# EasyEDA schematic SCH_PicoCounter_v2.json

## Sheets
1 Channel Inputs: TITLE: Channel Inputs; REV: 1.0; Date: 2021-10-09; Sheet: 1/1; Drawn By: fmefi; Company: Your Company
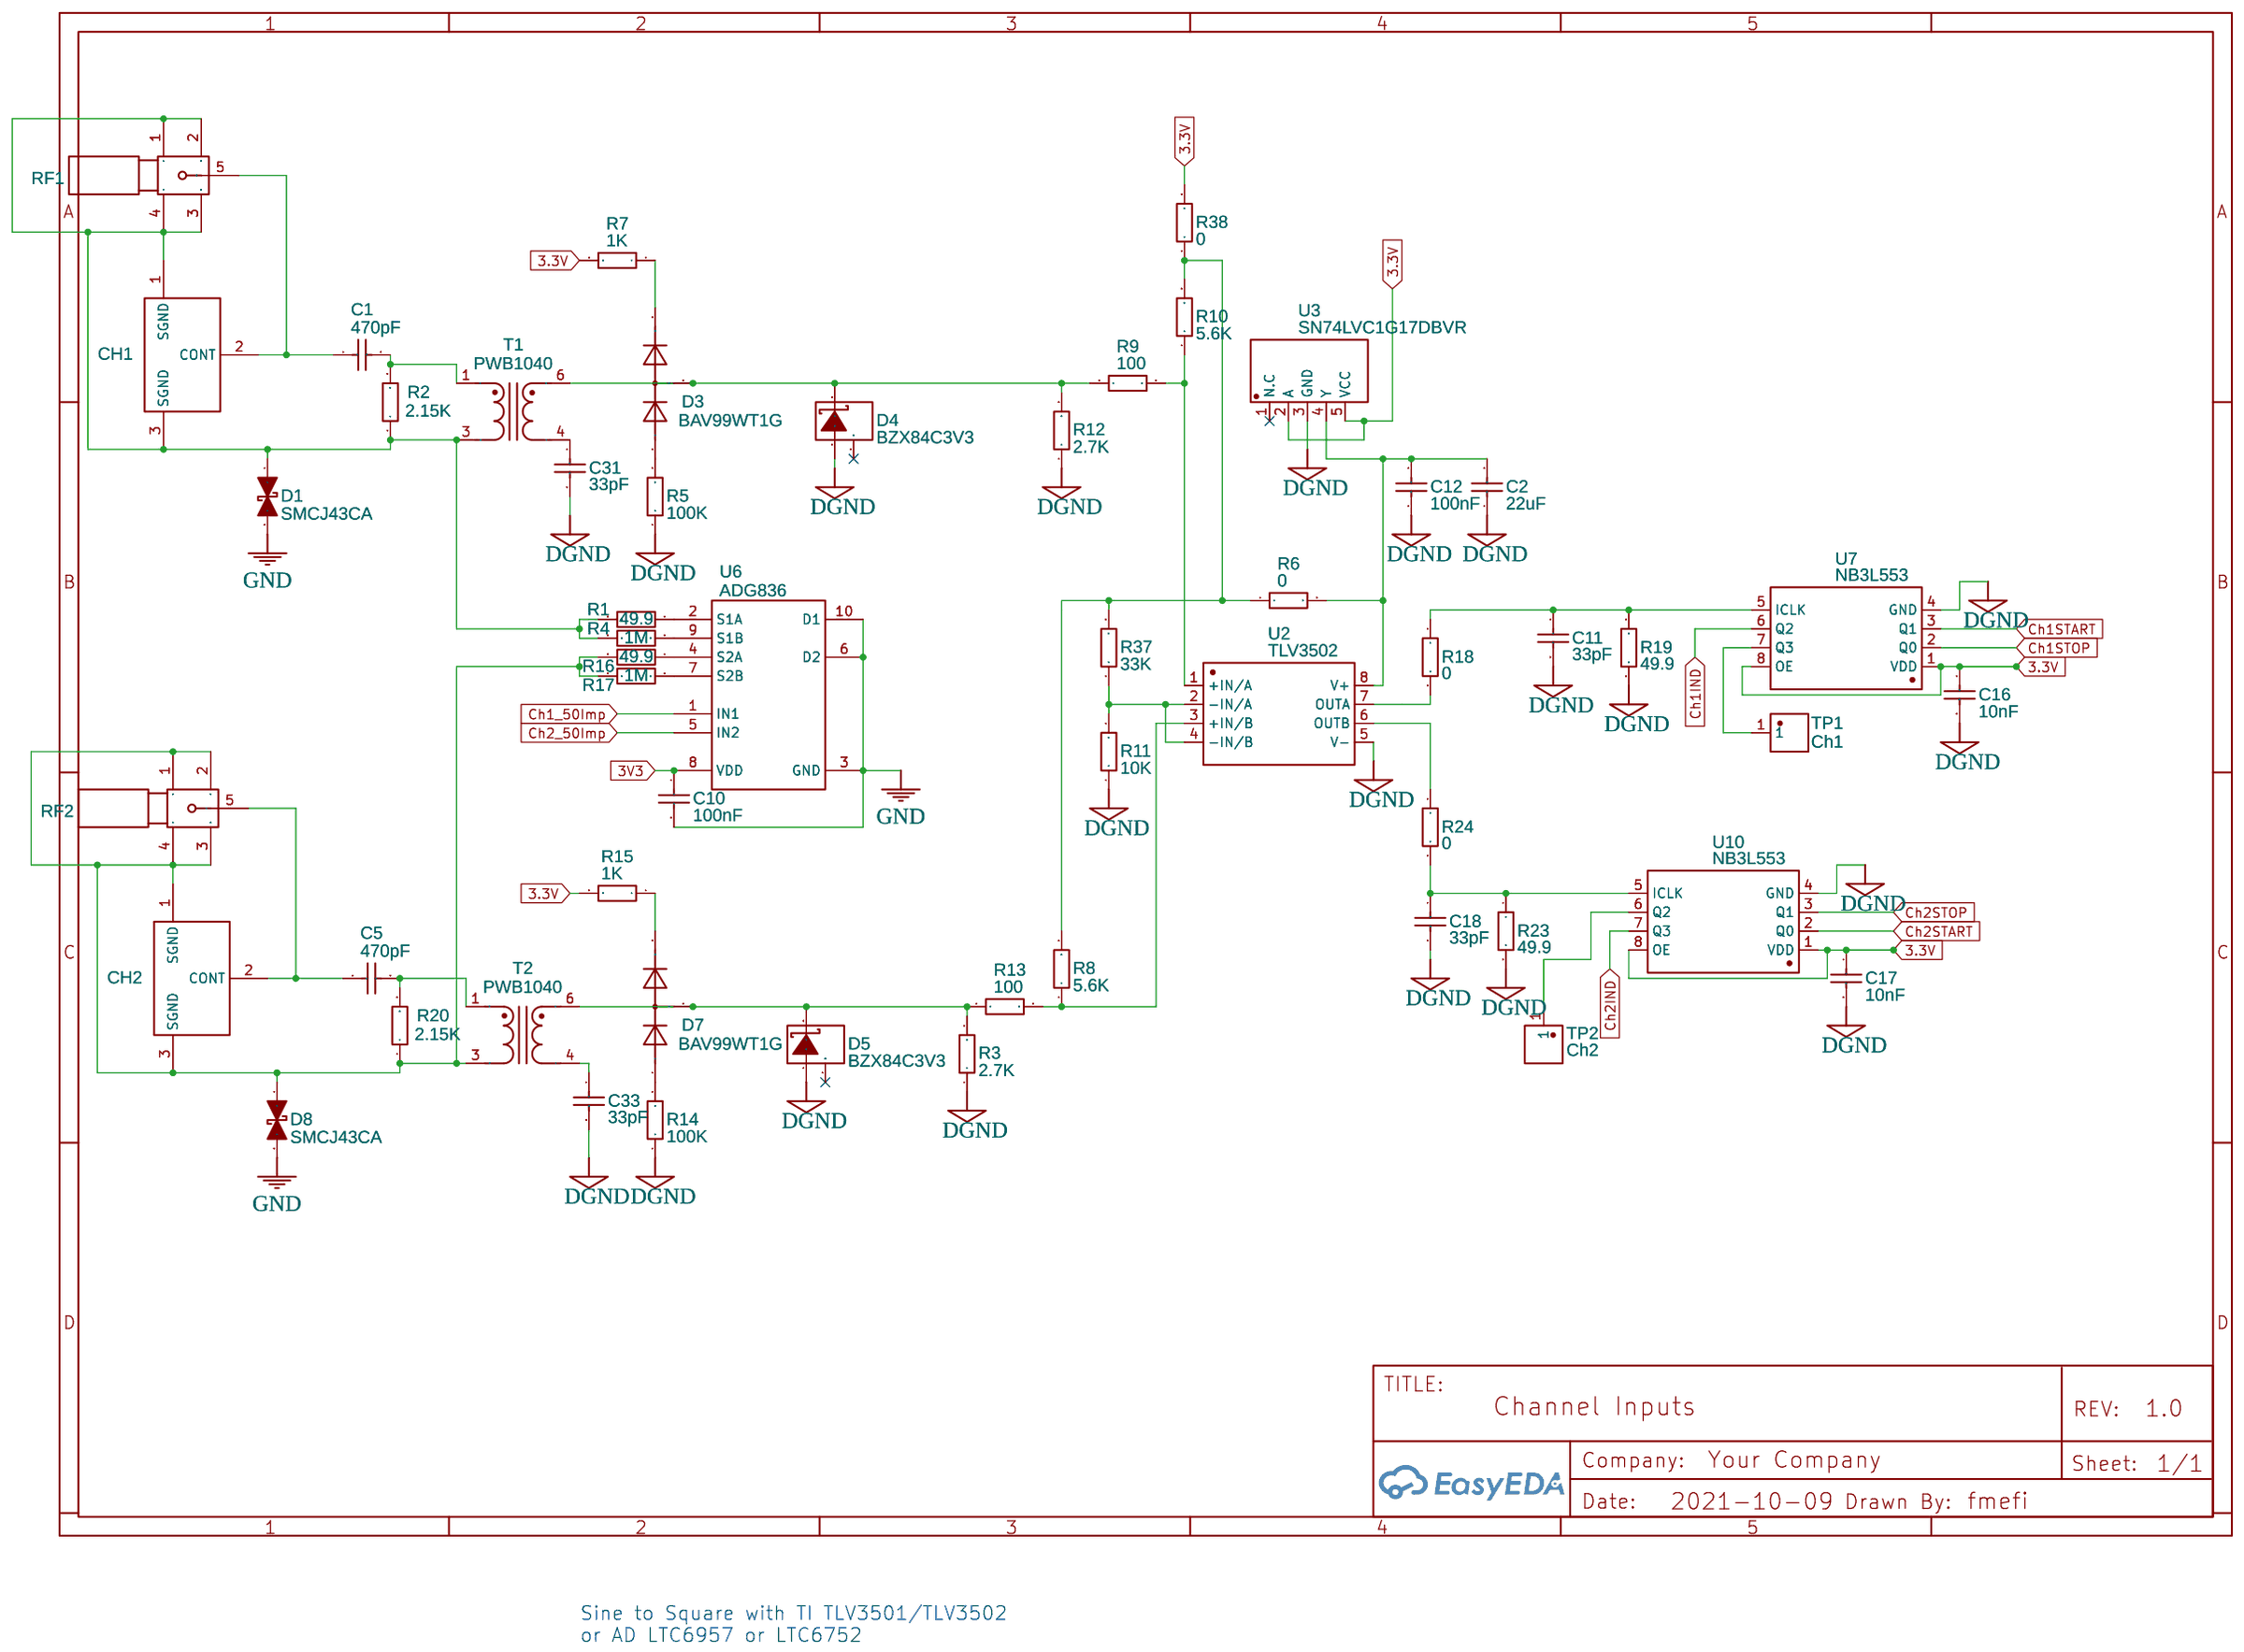
[diagram p0: Channel Inputs]
2 TDC7200: TITLE: TDC7200 Counter; Date: 2021-11-24
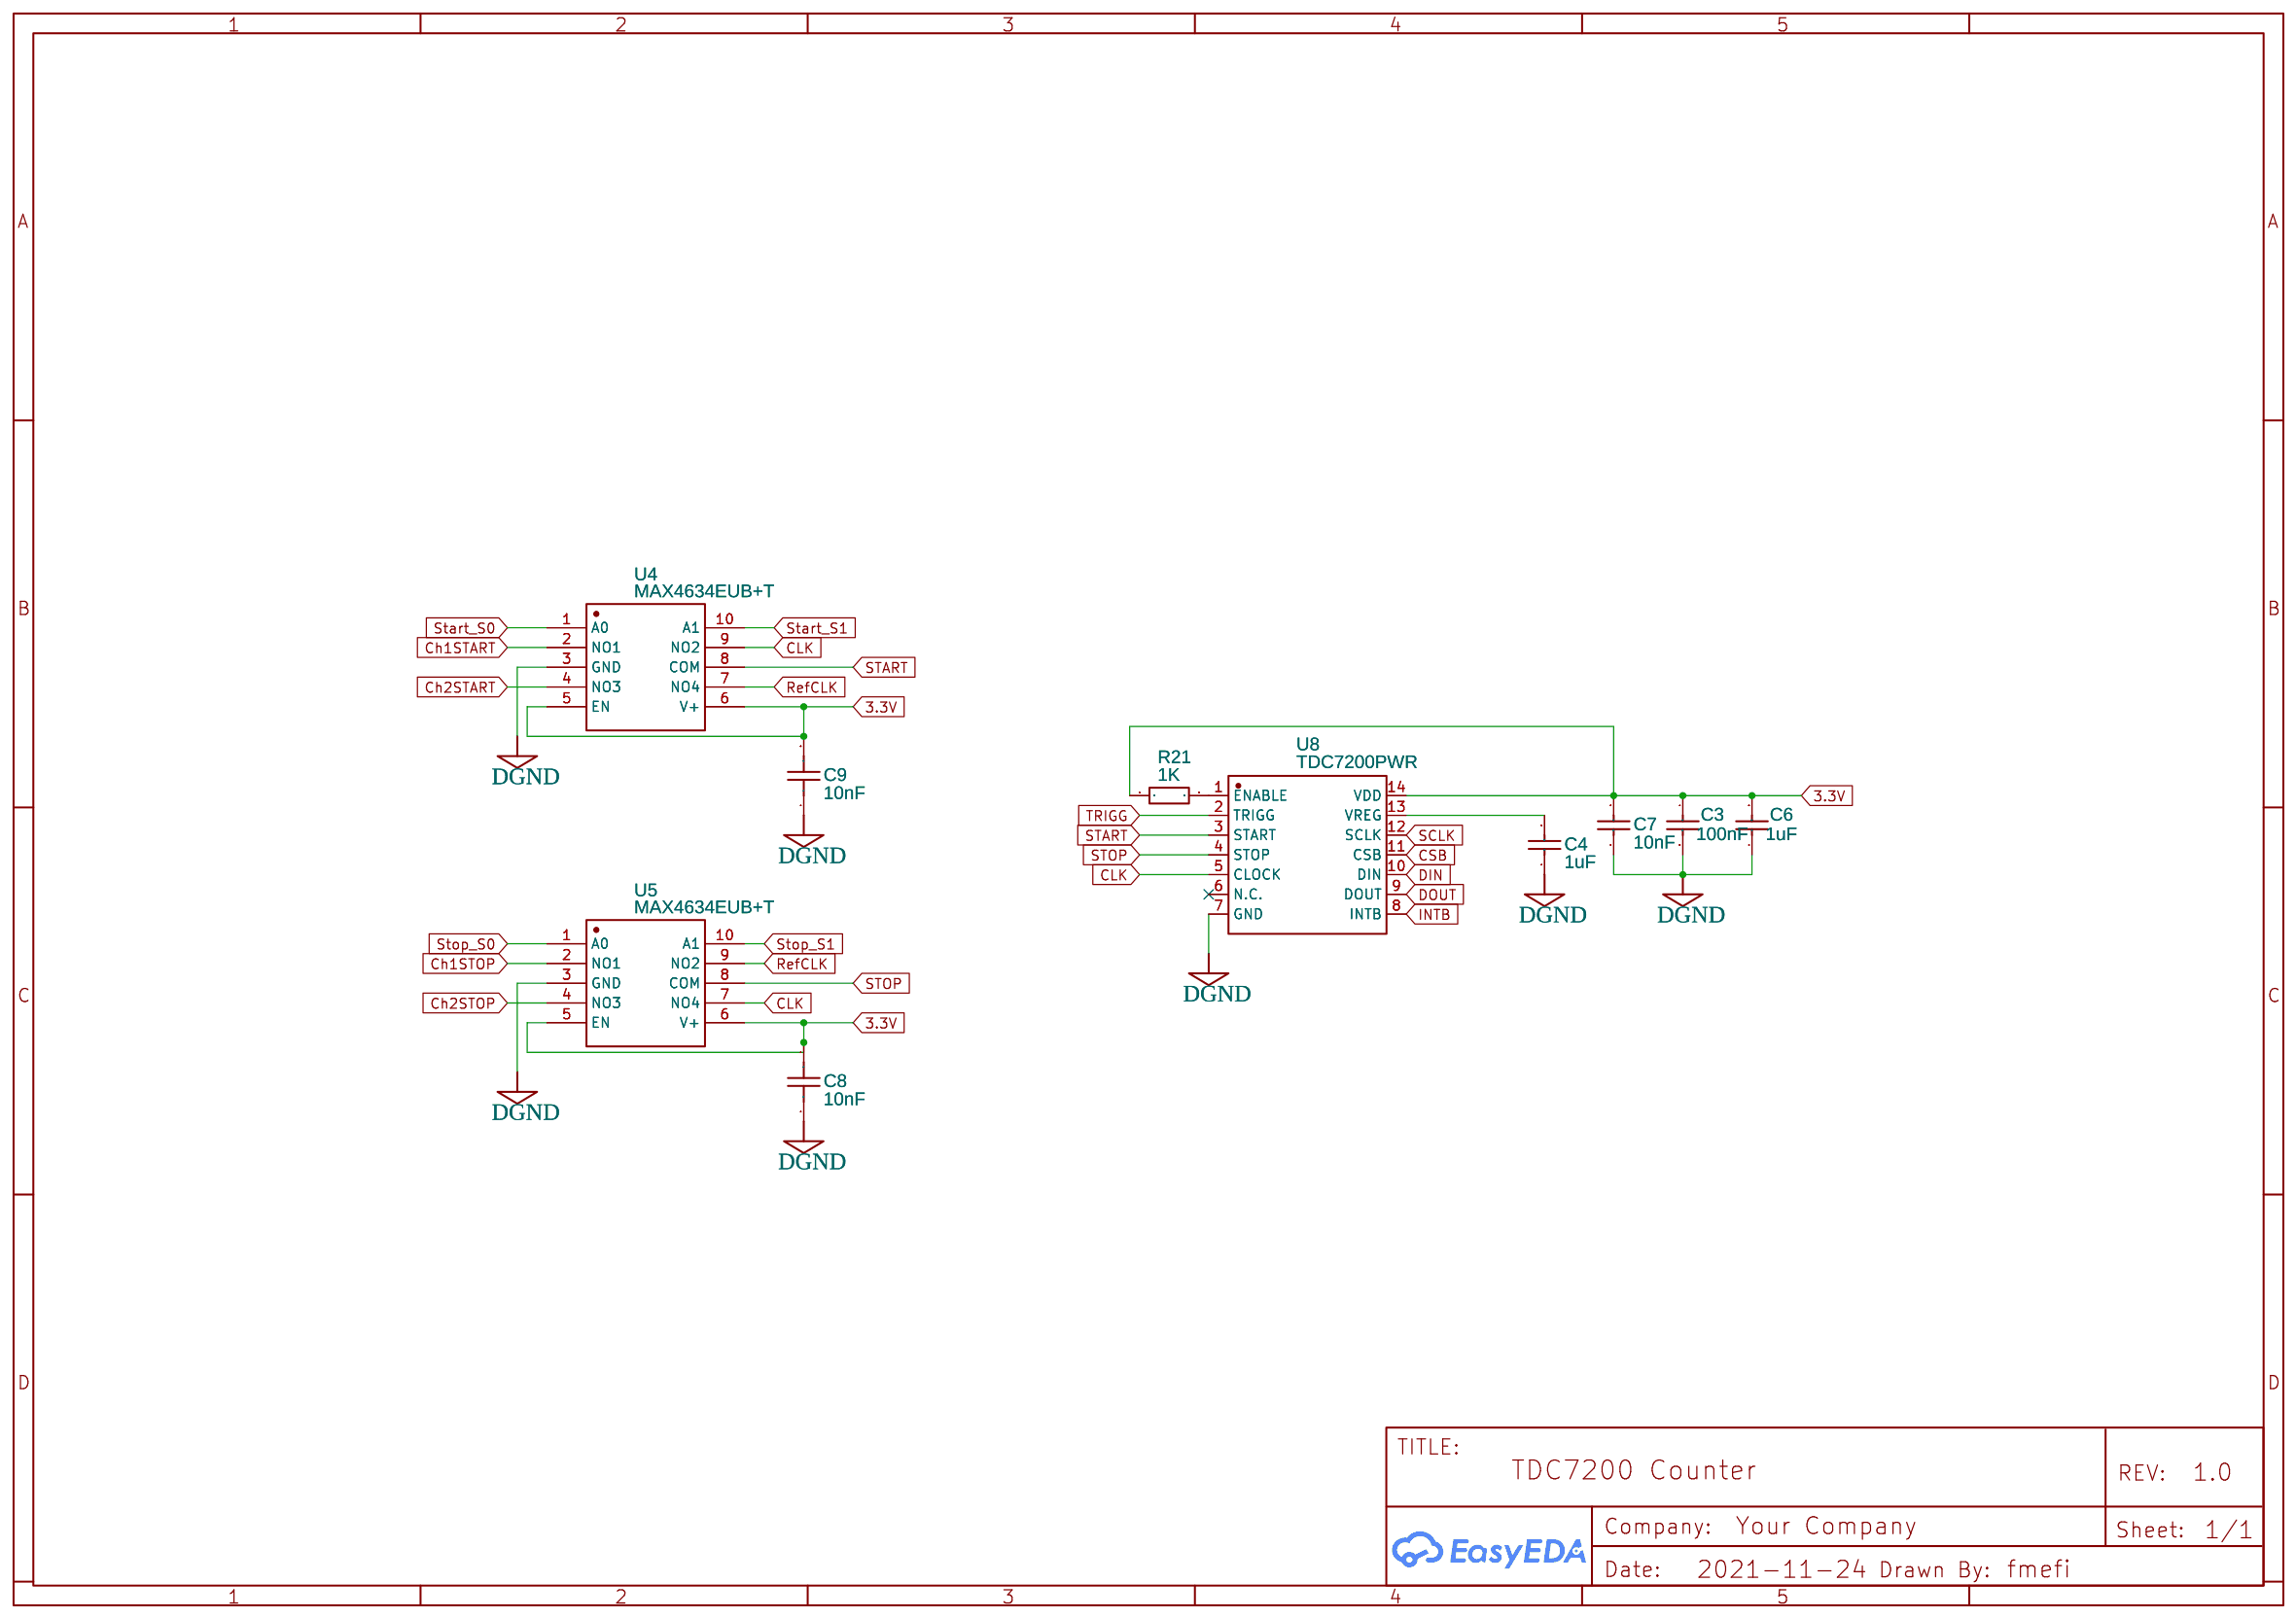
[diagram p1: TDC7200]
3 RPi Pico: TITLE: RPi Pico (Div Module); Date: 2021-11-24
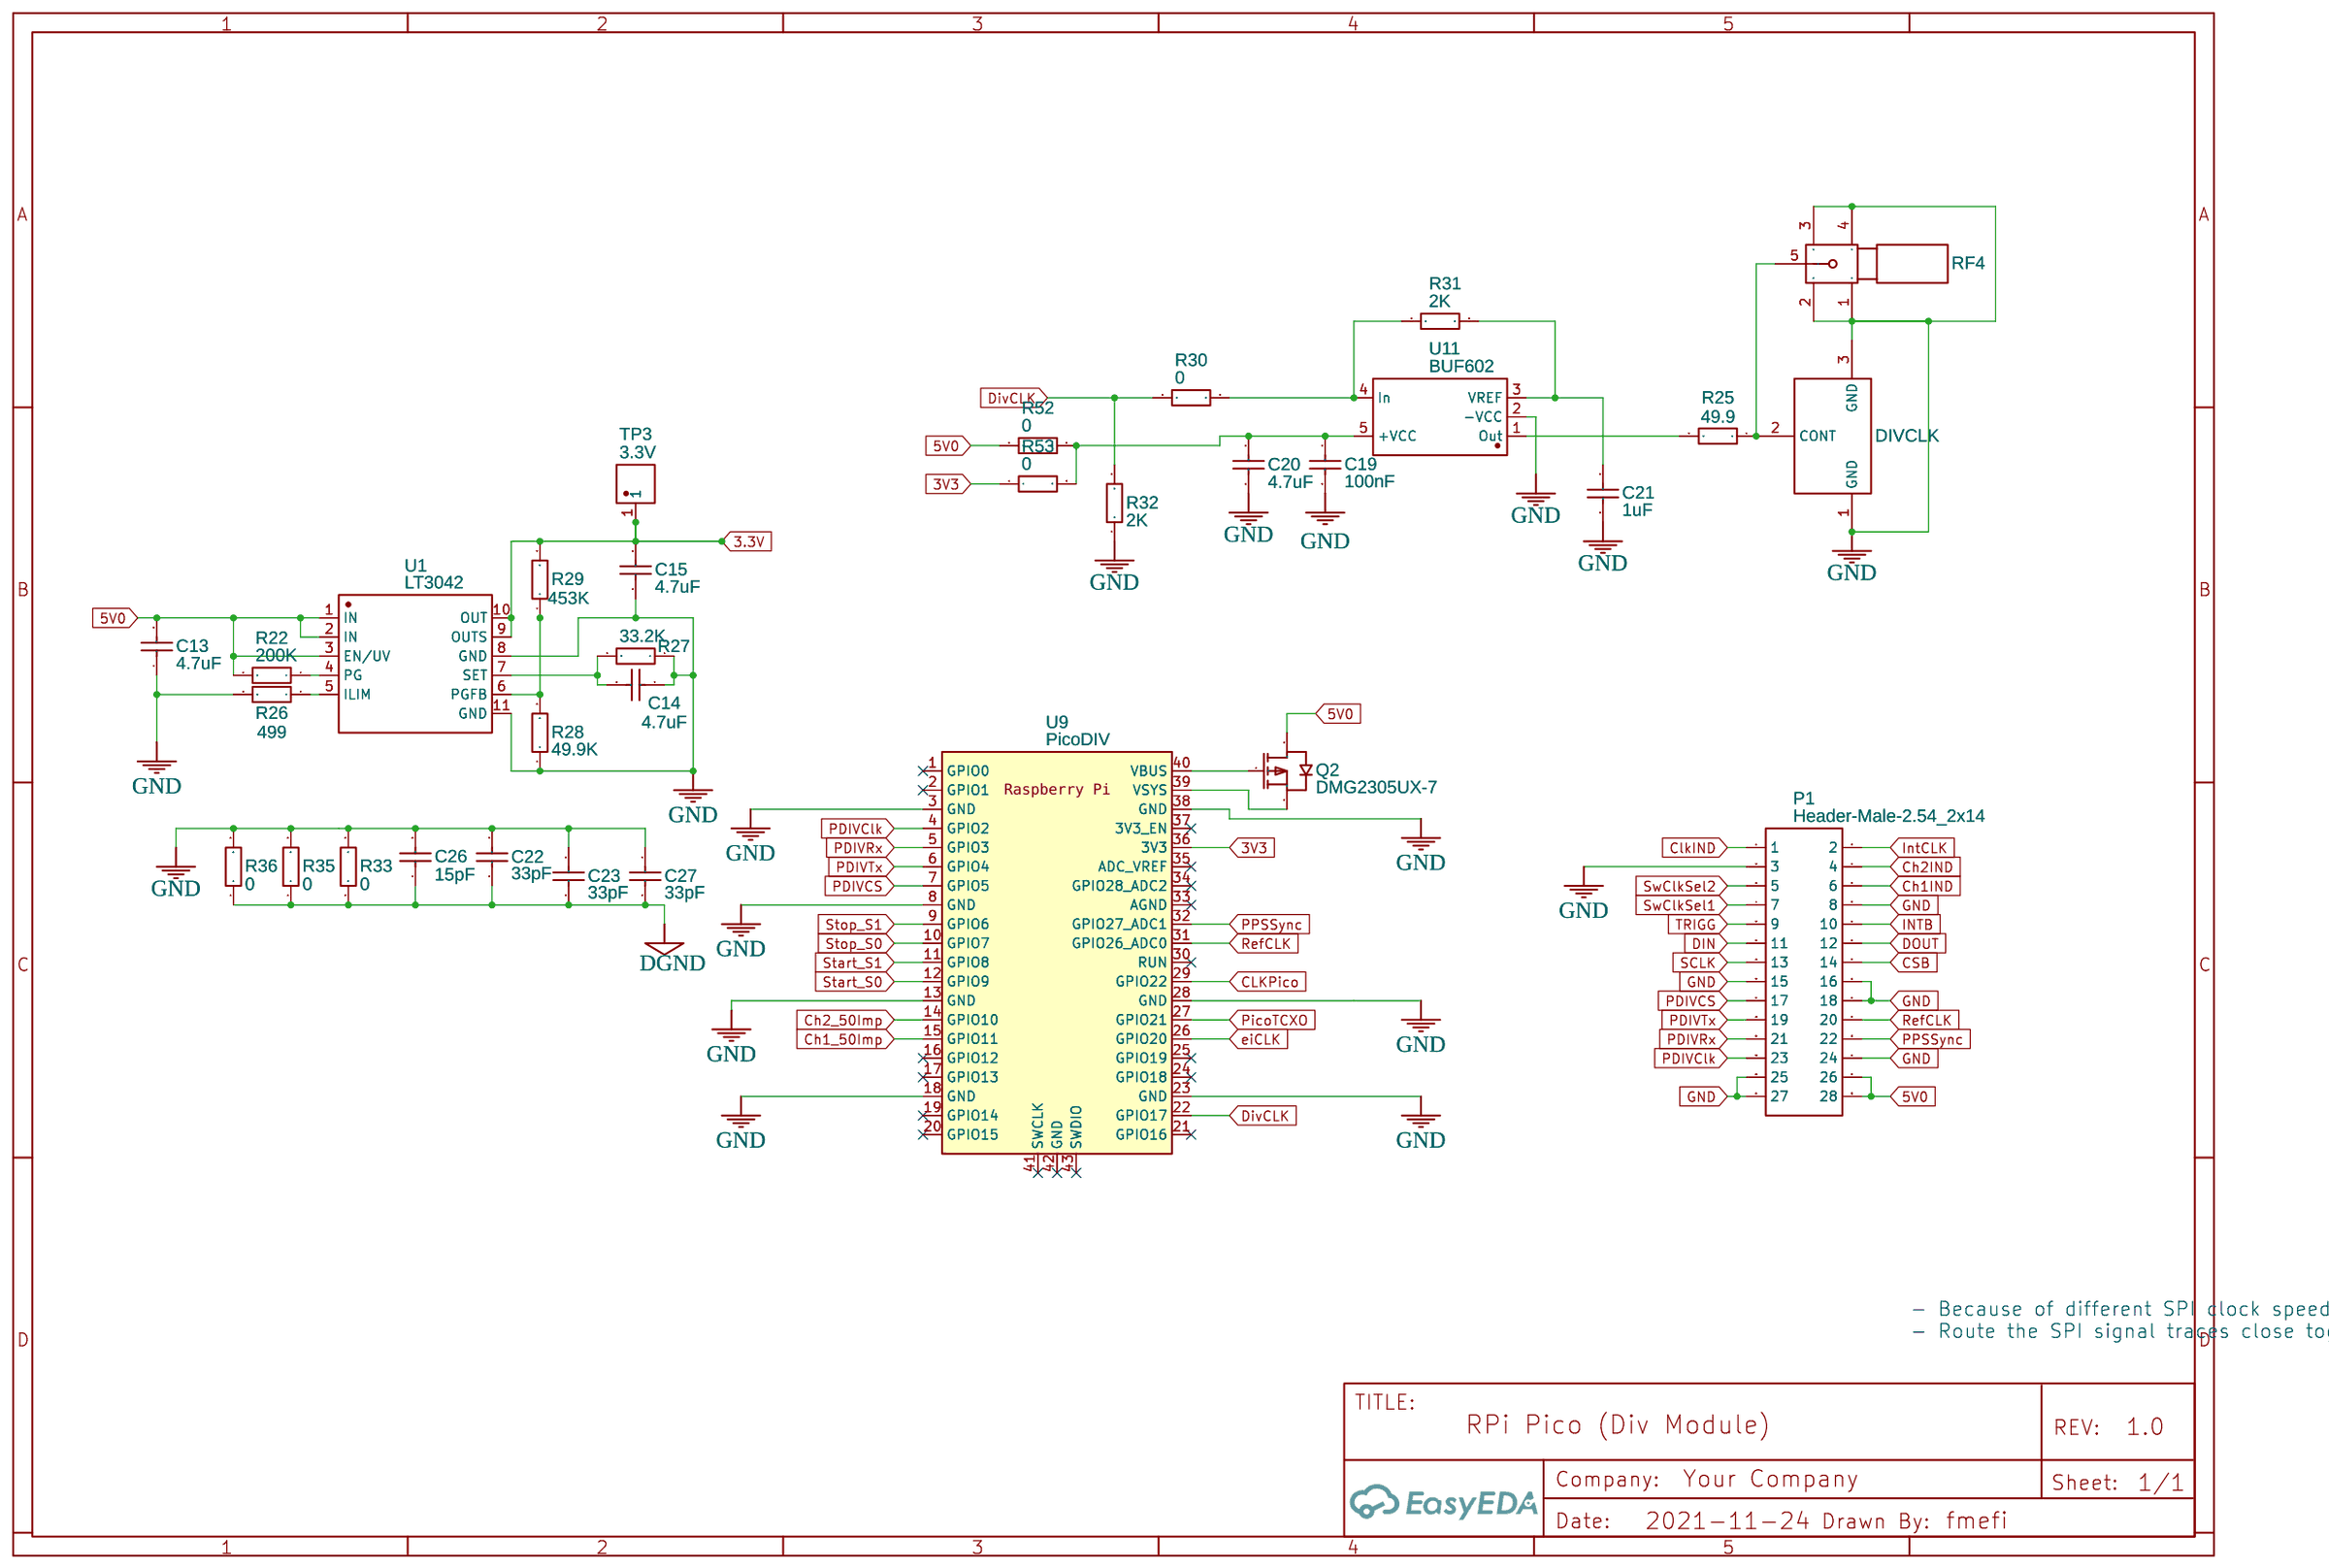
[diagram p2: RPi Pico]
4 Timebase: TITLE: Timebase; Date: 2021-11-25
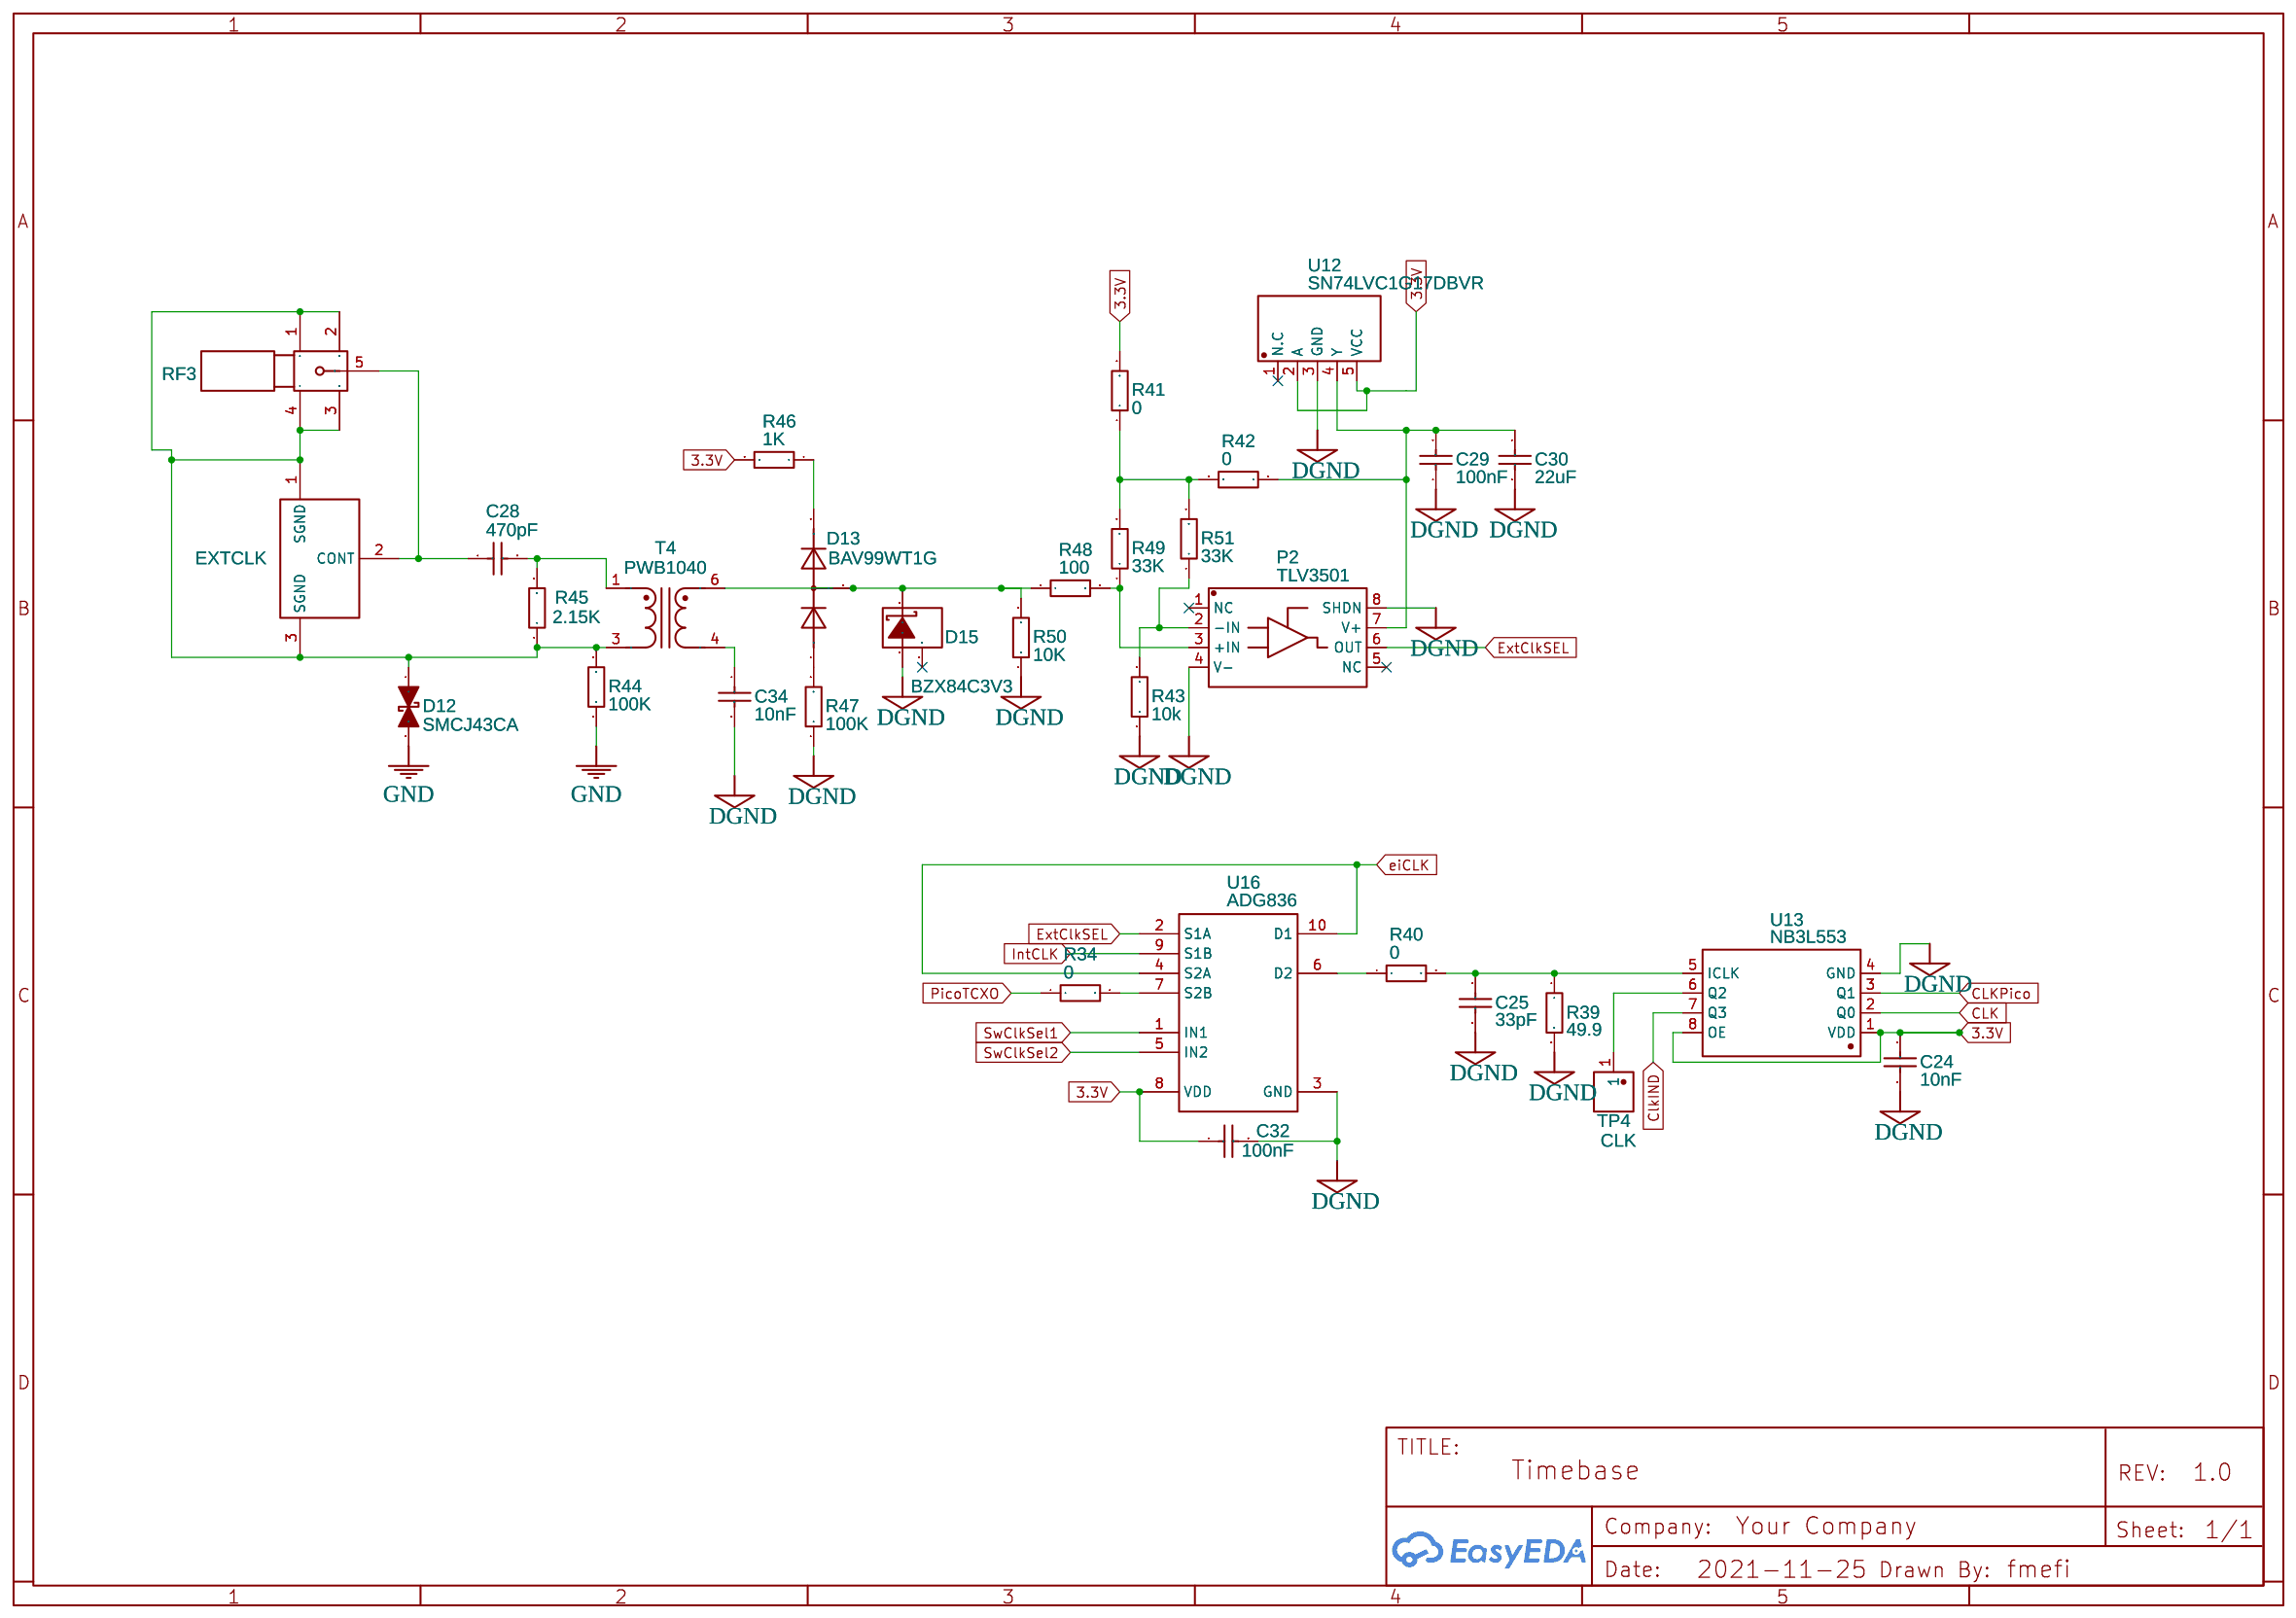
[diagram p3: Timebase]

## Parts
sheet Channel Inputs
C1  470pF  [C0805]
C2  22uF  [C0805]
C5  470pF  [C0805]
C10  100nF  [C0805]
C11  33pF  [C0805]
C12  100nF  [C0805]
C16  10nF  [C0805]
C17  10nF  [C0805]
C18  33pF  [C0805]
C31  33pF  [C0805]
C33  33pF  [C0805]
CH1  ChA  [ANT-SMD_KH-IPEX-K501-29]
CH2  ChA  [ANT-SMD_KH-IPEX-K501-29]
D1  SMCJ43CA  [SMC_L6.9-W5.9-LS7.9-BI]
D3  BAV99WT1G  [SC-70-3_L2.1-W1.3-P1.30-LS2.1-BR]
D4  BZX84C3V3  [SOT-23-3_L2.9-W1.3-P0.95-LS2.4-BR]
D5  BZX84C3V3  [SOT-23-3_L2.9-W1.3-P0.95-LS2.4-BR]
D7  BAV99WT1G  [SC-70-3_L2.1-W1.3-P1.30-LS2.1-BR]
D8  SMCJ43CA  [SMC_L6.9-W5.9-LS7.9-BI]
R1  49.9  [R0805]
R2  2.15K  [R0805]
R3  2.7K  [R0805]
R4  1M  [R0805]
R5  100K  [R0805]
R6  0  [R0805]
R7  1K  [R0805]
R8  5.6K  [R0805]
R9  100  [R0805]
R10  5.6K  [R0805]
R11  10K  [R0805]
R12  2.7K  [R0805]
R13  100  [R0805]
R14  100K  [R0805]
R15  1K  [R0805]
R16  49.9  [R0805]
R17  1M  [R0805]
R18  0  [R0805]
R19  49.9  [R0805]
R20  2.15K  [R0805]
R23  49.9  [R0805]
R24  0  [R0805]
R37  33K  [R0805]
R38  0  [R0805]
RF1  KH-SMA-KE8-G  [CONN-SMD_KH-SMA-KE8-G]
RF2  KH-SMA-KE8-G  [CONN-SMD_KH-SMA-KE8-G]
T1  PWB1040  [PWB1040 COILCRAFT]
T2  PWB1040  [PWB1040 COILCRAFT]
TP1  Ch1  [TP-SMD_RCUCTE]
TP2  Ch2  [TP-SMD_RCUCTE]
U2  TLV3502  [SOIC-8_L4.9-W3.9-P1.27-LS6.0-BL]
U3  SN74LVC1G17DBVR  [SOT-23-5_L3.0-W1.7-P0.95-LS2.8-BR]
U6  ADG836  [MSOP-10_L3.0-W3.0-P0.50-LS5.0-BL]
U7  NB3L553  [SOIC-8_L4.9-W3.9-P1.27-LS6.0-BL]
U10  NB3L553  [SOIC-8_L4.9-W3.9-P1.27-LS6.0-BL]
sheet RPi Pico
C13  4.7uF  [C0805]
C14  4.7uF  [C0805]
C15  4.7uF  [C0805]
C19  100nF  [C0805]
C20  4.7uF  [C0805]
C21  1uF  [C0805]
C22  33pF  [C0805]
C23  33pF  [C0805]
C26  15pF  [C0805]
C27  33pF  [C0805]
DIVCLK  DIVCLK  [ANT-SMD_KH-IPEX-K501-29]
P1  Header-Male-2.54_2x14  [HDR-TH_28P-P2.54-H-M-R2-C14-S2.54]
Q2  DMG2305UX-7  [SOT-23-3_L2.9-W1.3-P1.90-LS2.4-BR]
R22  200K  [R0805]
R25  49.9  [R0805]
R26  499  [R0805]
R27  33.2K  [R0805]
R28  49.9K  [R0805]
R29  453K  [R0805]
R30  0  [R0805]
R31  2K  [R0805]
R32  2K  [R0805]
R33  0  [R0805]
R35  0  [R0805]
R36  0  [R0805]
R52  0  [R0805]
R53  0  [R0805]
RF4  KH-SMA-KE8-G  [CONN-SMD_KH-SMA-KE8-G]
TP3  3.3V  [TP-SMD_RCUCTE]
U1  LT3042  [MSOP-10_L3.0-W3.0-P0.50-LS5.0-BL-EP]
U9  PicoDIV  [RPI_PICO_SMD_TH]
U11  BUF602  [SOT-23-5_L2.9-W1.6-P0.95-LS2.8-BL]
sheet TDC7200
C3  100nF  [C0805]
C4  1uF  [C0805]
C6  1uF  [C0805]
C7  10nF  [C0805]
C8  10nF  [C0805]
C9  10nF  [C0805]
R21  1K  [R0805]
U4  MAX4634EUB+T  [MSOP-10_L3.0-W3.0-P0.50-LS5.0-BL]
U5  MAX4634EUB+T  [MSOP-10_L3.0-W3.0-P0.50-LS5.0-BL]
U8  TDC7200PWR  [TSSOP-14_L5.0-W4.4-P0.65-LS6.4-BL]
sheet Timebase
C24  10nF  [C0805]
C25  33pF  [C0805]
C28  470pF  [C0805]
C29  100nF  [C0805]
C30  22uF  [C0805]
C32  100nF  [C0805]
C34  10nF  [C0805]
D12  SMCJ43CA  [SMC_L6.9-W5.9-LS7.9-BI]
D13  BAV99WT1G  [SC-70-3_L2.1-W1.3-P1.30-LS2.1-BR]
D15  BZX84C3V3  [SOT-23-3_L2.9-W1.3-P0.95-LS2.4-BR]
EXTCLK  ChA  [ANT-SMD_KH-IPEX-K501-29]
P2  TLV3501  [SOP-8_L4.9-W3.9-P1.27-LS6.0-BL]
R34  0  [R0805]
R39  49.9  [R0805]
R40  0  [R0805]
R41  0  [R0805]
R42  0  [R0805]
R43  10k  [R0805]
R44  100K  [R0805]
R45  2.15K  [R0805]
R46  1K  [R0805]
R47  100K  [R0805]
R48  100  [R0805]
R49  33K  [R0805]
R50  10K  [R0805]
R51  33K  [R0805]
RF3  KH-SMA-KE8-G  [CONN-SMD_KH-SMA-KE8-G]
T4  PWB1040  [PWB1040 COILCRAFT]
TP4  CLK  [TP-SMD_RCUCTE]
U12  SN74LVC1G17DBVR  [SOT-23-5_L3.0-W1.7-P0.95-LS2.8-BR]
U13  NB3L553  [SOIC-8_L4.9-W3.9-P1.27-LS6.0-BL]
U16  ADG836  [MSOP-10_L3.0-W3.0-P0.50-LS5.0-BL]

## Library data of the parts
C1 C5 C28 = CL21C471JBANNNC: Supplier: LCSC; Manufacturer: SAMSUNG; Supplier Part: C28256; JLCPCB Part Class: Extended Part
C2 C30 = CL21A226MPQNNNE: Supplier: LCSC; Manufacturer: SAMSUNG; Supplier Part: C29277; JLCPCB Part Class: Extended Part
C3 C10 C12 C19 C29 C32 = CC0805KRX7R9BB104: Supplier: LCSC; Manufacturer: YAGEO; Supplier Part: C49678; JLCPCB Part Class: Basic Part
C11 C18 C22 C23 C25 C27 C31 C33 = CL21C330JBANNNC: Supplier: LCSC; Manufacturer: SAMSUNG; Supplier Part: C1814; JLCPCB Part Class: Basic Part
C7 C16 C17 C24 C34 = CL21B103KBANNNC: Supplier: LCSC; Manufacturer: SAMSUNG; Supplier Part: C1710; JLCPCB Part Class: Basic Part
CH1 CH2 DIVCLK EXTCLK = KH-IPEX-K501-29: Supplier: LCSC; Supplier Part: C411563; Manufacturer: Shenzhen Kinghelm Elec; Contributor: LCSC; JLCPCB Part Class: Extended Part
D1 D8 D12 = SMCJ43CA: Supplier: LCSC; Supplier Part: C310053; Manufacturer: Brightking Elec (TAIWAN); Contributor: LCSC; JLCPCB Part Class: Extended Part
D3 D7 D13 = BAV99WT1G: Supplier Part: C82078; Supplier: LCSC; Manufacturer: ON; Contributor: LCSC; JLCPCB Part Class: Extended Part
D4 D5 D15 = SZBZX84C3V3LT1G: Supplier: LCSC; Supplier Part: C231240; Manufacturer: ON Semicon; Contributor: LCSC; JLCPCB Part Class: Extended Part
R1 R16 R19 R23 R25 R39 = 0805W8F499JT5E: Supplier: LCSC; Manufacturer: UniOhm; Supplier Part: C17720; JLCPCB Part Class: Basic Part
R2 R20 R45 = 0805W8F2151T5E: Supplier: LCSC; Manufacturer: UniOhm; Supplier Part: C17516; JLCPCB Part Class: Extended Part
R3 R12 = 0805W8F1002T5E: Supplier: LCSC; Manufacturer: UniOhm; Manufacturer Part: 0805W8F2701T5E; Supplier Part: C17530; JLCPCB Part Class: Basic Part
R4 R17 = 0805W8F1004T5E: Supplier: LCSC; Manufacturer: UniOhm; Supplier Part: C17514; JLCPCB Part Class: Basic Part
R5 R14 R44 R47 = 0805W8F1003T5E: Supplier: LCSC; Manufacturer: UniOhm; Supplier Part: C17407; JLCPCB Part Class: Basic Part
R6 R18 R24 R30 R33-R36 R38 R40-R42 R52 R53 = 0805W8F0000T5E: Supplier: LCSC; Manufacturer: UniOhm; Supplier Part: C17477; JLCPCB Part Class: Basic Part
R7 R15 R21 R46 = 0805W8F1001T5E: Supplier: LCSC; Manufacturer: UniOhm; Supplier Part: C17513; JLCPCB Part Class: Basic Part
R8 R10 = 0805W8F1003T5E: Supplier: LCSC; Manufacturer: UniOhm; Manufacturer Part: 0805W8F5601T5E; Supplier Part: C4382; JLCPCB Part Class: Basic Part
R9 R13 R48 = 0805W8F1000T5E: Supplier: LCSC; Manufacturer: UniOhm; Supplier Part: C17408; JLCPCB Part Class: Basic Part
R11 R43 = 0805W8F1000T5E: Supplier: LCSC; Manufacturer: UniOhm; Manufacturer Part: 0805W8F1002T5E; Supplier Part: C17414; JLCPCB Part Class: Basic Part
R37 R49 R51 = 0805W8F1003T5E: Supplier: LCSC; Manufacturer: UniOhm; Manufacturer Part: 0805W8F3302T5E; Supplier Part: C17633; JLCPCB Part Class: Basic Part
RF1-RF4 = KH-SMA-KE8-G: Supplier: LCSC; Supplier Part: C530661; Manufacturer: Shenzhen Kinghelm Elec; Contributor: LCSC; JLCPCB Part Class: Extended Part
T1 T2 T4 = PWB1040 COILCRAFT: Supplier: LCSC; Supplier Part: C581397; Manufacturer: Pulse Elec; Manufacturer Part: PE-68386NLT; Contributor: LCSC; JLCPCB Part Class: Extended Part
TP1-TP4 = RCUCTE: Supplier: LCSC; Supplier Part: C159867; Manufacturer: KOA; Contributor: LCSC
U2 = TLV3502AIDR: Supplier: LCSC; Manufacturer: TI; Contributor: LCSC; Supplier Part: C131165; JLCPCB Part Class: Extended Part
U3 U12 = SN74LVC1G17DBVR: Supplier: LCSC; Manufacturer: TI; Supplier Part: C7836; JLCPCB Part Class: Extended Part
U6 U16 = ADG836YRMZ: Supplier: LCSC; Supplier Part: C208153; Manufacturer: Analog Devices; Contributor: LCSC; JLCPCB Part Class: Extended Part
U7 U10 U13 = NB3L553DR2G: Supplier: LCSC; Manufacturer: ON; Contributor: LCSC; Supplier Part: C145512; JLCPCB Part Class: Extended Part
C13-C15 C20 = CL21A475KAQNNNE: Supplier: LCSC; Manufacturer: SAMSUNG; Supplier Part: C1779; JLCPCB Part Class: Basic Part
C4 C6 C21 = CL21B105KBFNNNE: Supplier: LCSC; Manufacturer: SAMSUNG; Supplier Part: C28323; JLCPCB Part Class: Basic Part
C26 = CL21C150JBANNNC: Supplier: LCSC; Manufacturer: SAMSUNG; Supplier Part: C1794; JLCPCB Part Class: Basic Part
P1 = Header-Male-2.54_2x14: Supplier: LCSC; Manufacturer: Ckmtw; Manufacturer Part: 210R-2*14PCurved needle Gold-plated black; Contributor: LCSC; Supplier Part: C124368; JLCPCB Part Class: Extended Part
Q2 = DMG2305UX-7: Supplier: LCSC; Supplier Part: C150470; Manufacturer: Diodes Incorporated; Contributor: LCSC; JLCPCB Part Class: Extended Part
R22 = 0805W8F2003T5E: Supplier: LCSC; Manufacturer: UniOhm; Supplier Part: C17539; JLCPCB Part Class: Basic Part
R26 = 0805W8F4990T5E: Supplier: LCSC; Manufacturer: UniOhm; Supplier Part: C17722; JLCPCB Part Class: Extended Part
R27 = 0805W8F3322T5E: Supplier: LCSC; Manufacturer: UniOhm; Supplier Part: C37252; JLCPCB Part Class: Extended Part
R28 = 0805W8F4992T5E: Supplier: LCSC; Manufacturer: UniOhm; Supplier Part: C17719; JLCPCB Part Class: Basic Part
R29 = 0805W8F4533T5E: Supplier: LCSC; Manufacturer: UniOhm; Supplier Part: C17702; JLCPCB Part Class: Extended Part
R31 R32 = 0805W8F2001T5E: Supplier: LCSC; Manufacturer: UniOhm; Supplier Part: C17604; JLCPCB Part Class: Basic Part
U1 = LT3042EMSE#PBF: Supplier: LCSC; Manufacturer: LINEAR; Supplier Part: C69847; JLCPCB Part Class: Extended Part
U9 = Pico: Contributor: Alexey Gumenchuk
U11 = BUF602IDBVR: Supplier: LCSC; Supplier Part: C2060701; Manufacturer: TI(德州仪器); JLCPCB Part Class: Extended Part; Contributor: LCSC
C8 C9 = CC0805KRX7R9BB103: Supplier: LCSC; Manufacturer: YAGEO; Supplier Part: C83170; JLCPCB Part Class: Extended Part
U4 U5 = MAX4634EUB+T: Supplier: LCSC; Manufacturer: MAXIM; Contributor: LCSC; Supplier Part: C118342; JLCPCB Part Class: Extended Part
U8 = TDC7200PWR: Supplier: LCSC; Supplier Part: C2653139; Manufacturer: TI(德州仪器); Contributor: LCSC; JLCPCB Part Class: Extended Part
P2 = TLV3501AIDR: Supplier: LCSC; Manufacturer: TI; Supplier Part: C43484; JLCPCB Part Class: Extended Part
R50 = 0805W8F1002T5E: Supplier: LCSC; Manufacturer: UniOhm; Supplier Part: C17414; JLCPCB Part Class: Basic Part

## Nets
3.3V: C3.1 C6.2 C7.2 C8.2 C9.2 C15.2 C16.1 C17.1 C24.1 C32.1 R7.2 R15.2 R21.1 R29.2 R38.2 R41.2 R46.2 TP3.1 U1.9(OUTS) U1.10(OUT) U3.2(A) U3.5(VCC) U4.5(EN) U4.6(V+) U5.5(EN) U5.6(V+) U7.1(VDD) U7.8(OE) U8.14(VDD) U10.1(VDD) U10.8(OE) U12.2(A) U12.5(VCC) U13.1(VDD) U13.8(OE) U16.8(VDD)
3V3: C10.1 R53.1 U6.8(VDD) U9.36(3V3)
5V0: C13.2 P1.26 P1.28 Q2.3(D) R22.2 R52.1 U1.1(IN) U1.2(IN) U1.3(EN/UV)
DGND: C2.1 C3.2 C4.1 C6.1 C7.1 C8.1 C9.1 C11.2 C12.1 C16.2 C17.2 C18.2 C22.1 C23.1 C24.2 C25.2 C26.1 C27.1 C29.1 C30.1 C31.2 C32.2 C33.2 C34.2 D4.1(A) D5.1(A) D15.1(A) P2.4(V-) P2.8(SHDN) R3.1 R5.1 R11.1 R12.1 R14.1 R19.2 R23.2 R33.1 R35.1 R36.1 R39.2 R43.1 R47.1 R50.1 U2.5(V-) U3.3(GND) U4.3(GND) U5.3(GND) U7.4(GND) U8.7(GND) U10.4(GND) U12.3(GND) U13.4(GND) U16.3(GND)
GND: C10.2 C13.1 C14.1 C15.1 C19.2 C20.2 C21.1 C22.2 C23.2 C26.2 C27.2 D1.2(A) D8.2(A) D12.2(A) DIVCLK.1(GND) DIVCLK.3(GND) P1.3 P1.8 P1.15 P1.16 P1.18 P1.24 P1.25 P1.27 R26.2 R27.1 R28.1 R32.1 R33.2 R35.2 R36.2 R44.1 RF4.1 RF4.2 RF4.3 RF4.4 U1.8(GND) U1.11(GND) U6.3(GND) U6.6(D2) U6.10(D1) U9.3(GND) U9.8(GND) U9.13(GND) U9.18(GND) U9.23(GND) U9.28(GND) U9.38(GND) U11.2(−VCC)
Ch1_50Imp: U6.1(IN1) U9.15(GPIO11)
Ch1IND: P1.6 U7.6(Q2)
Ch1START: U4.2(NO1) U7.3(Q1)
Ch1STOP: U5.2(NO1) U7.2(Q0)
Ch2_50Imp: U6.5(IN2) U9.14(GPIO10)
Ch2IND: P1.4 U10.7(Q3)
Ch2START: U4.4(NO3) U10.2(Q0)
Ch2STOP: U5.4(NO3) U10.3(Q1)
CLK: U4.9(NO2) U5.7(NO4) U8.5(CLOCK) U13.2(Q0)
ClkIND: P1.1 U13.7(Q3)
CLKPico: U9.29(GPIO22) U13.3(Q1)
CSB: P1.14 U8.11(CSB)
DIN: P1.11 U8.10(DIN)
DivCLK: R30.1 R32.2 U9.22(GPIO17)
DOUT: P1.12 U8.9(DOUT)
eiCLK: U9.26(GPIO20) U16.4(S2A) U16.10(D1)
ExtClkSEL: P2.6(OUT) U16.2(S1A)
INTB: P1.10 U8.8(INTB)
IntCLK: P1.2 U16.9(S1B)
PDIVClk: P1.23 U9.4(GPIO2)
PDIVCS: P1.17 U9.7(GPIO5)
PDIVRx: P1.21 U9.5(GPIO3)
PDIVTx: P1.19 U9.6(GPIO4)
PicoTCXO: R34.1 U9.27(GPIO21)
PPSSync: P1.22 U9.32(GPIO27_ADC1)
RefCLK: P1.20 U4.7(NO4) U5.9(NO2) U9.31(GPIO26_ADC0)
SCLK: P1.13 U8.12(SCLK)
START: U4.8(COM) U8.3(START)
Start_S0: U4.1(A0) U9.12(GPIO9)
Start_S1: U4.10(A1) U9.11(GPIO8)
STOP: U5.8(COM) U8.4(STOP)
Stop_S0: U5.1(A0) U9.10(GPIO7)
Stop_S1: U5.10(A1) U9.9(GPIO6)
SwClkSel1: P1.7 U16.1(IN1)
SwClkSel2: P1.5 U16.5(IN2)
TRIGG: P1.9 U8.2(TRIGG)
Net-(C1-1): C1.1 CH1.2(CONT) RF1.5
Net-(C1-2): C1.2 R2.2 T1.1
Net-(C2-2): C2.2 C12.2 R6.2 U2.8(V+) U3.4(Y)
Net-(C4-2): C4.2 U8.13(VREG)
Net-(C5-1): C5.1 CH2.2(CONT) RF2.5
Net-(C5-2): C5.2 R20.2 T2.1
Net-(C11-1): C11.1 R18.1 R19.1 U7.5(ICLK)
Net-(C14-2): C14.2 R27.2 U1.7(SET)
Net-(C18-1): C18.1 R23.1 R24.2 U10.5(ICLK)
Net-(C19-1): C19.1 C20.1 R52.2 R53.2 U11.5(+VCC)
Net-(C21-2): C21.2 R31.2 U11.3(VREF)
Net-(C25-1): C25.1 R39.1 R40.2 U13.5(ICLK)
Net-(C28-1): C28.1 EXTCLK.2(CONT) RF3.5
Net-(C28-2): C28.2 R45.2 T4.1
Net-(C29-2): C29.2 C30.2 P2.7(V+) R42.1 U12.4(Y)
Net-(C31-1): C31.1 T1.4
Net-(C33-1): C33.1 T2.4
Net-(C34-1): C34.1 T4.4
Net-(CH1-1): CH1.1(SGND) CH1.3(SGND) D1.1(K) R1.2 R2.1 R4.1 RF1.1 RF1.2 RF1.3 RF1.4 T1.3
Net-(CH2-1): CH2.1(SGND) CH2.3(SGND) D8.1(K) R16.2 R17.1 R20.1 RF2.1 RF2.2 RF2.3 RF2.4 T2.3
Net-(D3-1): D3.1(A) R5.2
Net-(D3-2): D3.2(C) R7.1
Net-(D3-3): D3.3(A/C) D4.3(K) R9.1 R12.2 T1.6
Net-(D5-3): D5.3(K) D7.3(A/C) R3.2 R13.1 T2.6
Net-(D7-1): D7.1(A) R14.2
Net-(D7-2): D7.2(C) R15.1
Net-(D12-1): D12.1(K) EXTCLK.1(SGND) EXTCLK.3(SGND) R44.2 R45.1 RF3.1 RF3.2 RF3.3 RF3.4 T4.3
Net-(D13-1): D13.1(A) R47.2
Net-(D13-2): D13.2(C) R46.1
Net-(D13-3): D13.3(A/C) D15.3(K) R48.1 R50.2 T4.6
Net-(DIVCLK-2): DIVCLK.2(CONT) R25.1 RF4.5
Net-(P2-2): P2.2(-IN) R43.2 R51.1
Net-(P2-3): P2.3(+IN) R48.2 R49.1
Net-(Q2-1): Q2.1(G) U9.40(VBUS)
Net-(Q2-2): Q2.2(S) U9.39(VSYS)
Net-(R1-1): R1.1 U6.2(S1A)
Net-(R4-2): R4.2 U6.9(S1B)
Net-(R6-1): R6.1 R8.2 R10.2 R37.2 R38.1
Net-(R8-1): R8.1 R13.2 U2.3(+IN/B)
Net-(R9-2): R9.2 R10.1 U2.1(+IN/A)
Net-(R11-2): R11.2 R37.1 U2.2(-IN/A) U2.4(-IN/B)
Net-(R16-1): R16.1 U6.4(S2A)
Net-(R17-2): R17.2 U6.7(S2B)
Net-(R18-2): R18.2 U2.7(OUTA)
Net-(R21-2): R21.2 U8.1(ENABLE)
Net-(R22-1): R22.1 U1.4(PG)
Net-(R24-1): R24.1 U2.6(OUTB)
Net-(R25-2): R25.2 U11.1(Out)
Net-(R26-1): R26.1 U1.5(ILIM)
Net-(R28-2): R28.2 R29.1 U1.6(PGFB)
Net-(R30-2): R30.2 R31.1 U11.4(In)
Net-(R34-2): R34.2 U16.7(S2B)
Net-(R40-1): R40.1 U16.6(D2)
Net-(R41-1): R41.1 R42.2 R49.2 R51.2
Net-(TP1-1): TP1.1 U7.7(Q3)
Net-(TP2-1): TP2.1 U10.6(Q2)
Net-(TP4-1): TP4.1 U13.6(Q2)

Not connected (* = marked no-connect by the designer): D4 2(NC)*; D5 2(NC)*; D15 2(NC)*; P2 1(NC)* 5(NC)*; U3 1(N.C)*; U8 6(N.C.)*; U9 1(GPIO0)* 2(GPIO1)* 16(GPIO12)* 17(GPIO13)* 19(GPIO14)* 20(GPIO15)* 21(GPIO16)* 24(GPIO18)* 25(GPIO19)* 30(RUN)* 33(AGND)* 34(GPIO28_ADC2)* 35(ADC_VREF)* 37(3V3_EN)* 41(SWCLK)* 42(GND)* 43(SWDIO)*; U12 1(N.C)*

## Notes on the sheets
sheet 1
- Sine to Square with TI TLV3501/TLV3502
  or AD LTC6957 or LTC6752
  SPI and digital wires should be on the bottom side
  Place a series resistor at the source of DOUT (close to the TDC7200) and series resistors at the sources of DIN, SCLK, and CSB (close to the master MCU).
  Moznie nie je zly napad doplnit odpor pred START, STOP a CLK pins TDC7200.
sheet 3
- - Because of different SPI clock speeds 2 SPI buses are used
  - Route the SPI signal traces close together. Place a series resistor at the source of DOUT (close to the TDC7200) and series resistors at the sources of DIN, SCLK, and CSB (close to the master MCU).
